# EAGLE schematic LCD_side_Adalogger (EAGLE 9.5.1)
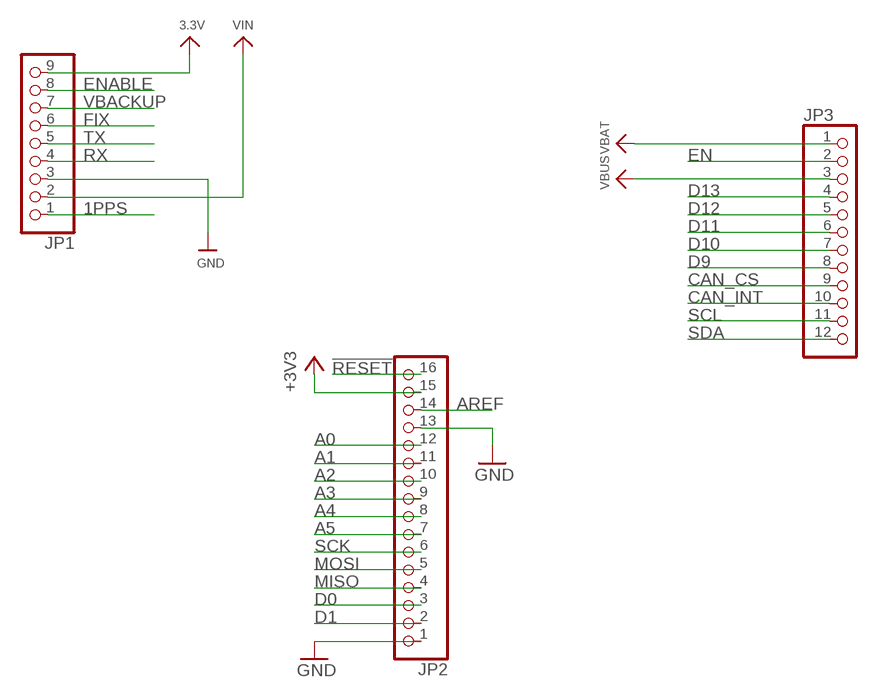
[diagram p0: schematic, sheet 1]

## Parts
JP1  HEADER-1X970MIL  [1X09_ROUND_70]
JP2  HEADER-1X16ROUND  [1X16_ROUND]
JP3  HEADER-1X12  [1X12_ROUND]

## Nets
1PPS: JP1.1
3.3V: JP1.9
!RESET: JP2.16
+3V3: JP2.15
A0: JP2.12
A1: JP2.11
A2: JP2.10
A3: JP2.9
A4: JP2.8
A5: JP2.7
AREF: JP2.14
CAN_CS: JP3.9
CAN_INT: JP3.10
D0: JP2.3
D1: JP2.2
D9: JP3.8
D10: JP3.7
D11: JP3.6
D12: JP3.5
D13: JP3.4
EN: JP3.2
ENABLE: JP1.8
FIX: JP1.6
GND: JP1.3 JP2.1 JP2.13
MISO: JP2.4
MOSI: JP2.5
RX: JP1.4
SCK: JP2.6
SCL: JP3.11
SDA: JP3.12
TX: JP1.5
VBACKUP: JP1.7
VBAT: JP3.1
VBUS: JP3.3
VIN: JP1.2

## Library data of the parts
JP1 = microbuilder:HEADER-1X9: PIN HEADER
JP2 = microbuilder:HEADER-1X16: PIN HEADER
JP3 = microbuilder:HEADER-1X12